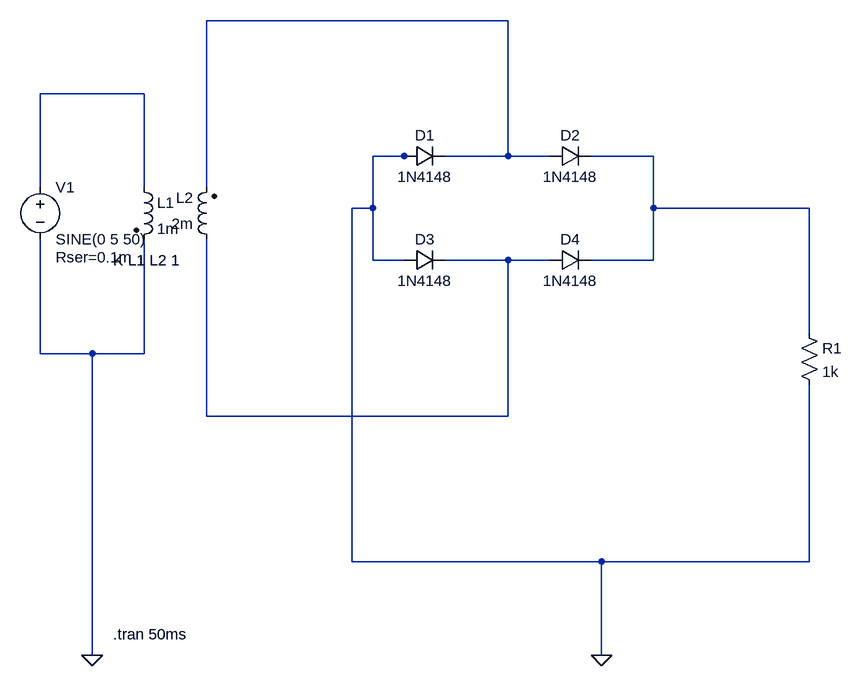
[diagram p0: schematic Resistive_Load_Full_Wave_Rectifier.asc]
Resistive_Load_Full_Wave_Rectifier.asc, the LTspice schematic file:
Version 4
SHEET 1 880 916
WIRE 224 -80 -240 -80
WIRE -336 32 -496 32
WIRE 64 128 16 128
WIRE 80 128 64 128
WIRE 224 128 224 -80
WIRE 224 128 128 128
WIRE 288 128 224 128
WIRE 448 128 352 128
WIRE -496 176 -496 32
WIRE -336 176 -336 32
WIRE -240 176 -240 -80
WIRE 16 208 16 128
WIRE 16 208 -16 208
WIRE 448 208 448 128
WIRE 688 208 448 208
WIRE 16 288 16 208
WIRE 64 288 16 288
WIRE 224 288 128 288
WIRE 288 288 224 288
WIRE 448 288 448 208
WIRE 448 288 352 288
WIRE 688 400 688 208
WIRE -496 432 -496 256
WIRE -416 432 -496 432
WIRE -336 432 -336 256
WIRE -336 432 -416 432
WIRE -240 528 -240 256
WIRE 224 528 224 288
WIRE 224 528 -240 528
WIRE -16 752 -16 208
WIRE 368 752 -16 752
WIRE 688 752 688 480
WIRE 688 752 368 752
WIRE -416 896 -416 432
WIRE 368 896 368 752
FLAG -416 896 0
FLAG 368 896 0
SYMBOL diode 64 144 R270
WINDOW 0 32 32 VTop 2
WINDOW 3 0 32 VBottom 2
SYMATTR InstName D1
SYMATTR Value 1N4148
SYMBOL diode 288 144 R270
WINDOW 0 32 32 VTop 2
WINDOW 3 0 32 VBottom 2
SYMATTR InstName D2
SYMATTR Value 1N4148
SYMBOL diode 64 304 R270
WINDOW 0 32 32 VTop 2
WINDOW 3 0 32 VBottom 2
SYMATTR InstName D3
SYMATTR Value 1N4148
SYMBOL diode 288 304 R270
WINDOW 0 32 32 VTop 2
WINDOW 3 0 32 VBottom 2
SYMATTR InstName D4
SYMATTR Value 1N4148
SYMBOL voltage -496 160 R0
WINDOW 123 0 0 Left 0
WINDOW 39 24 124 Left 2
SYMATTR InstName V1
SYMATTR Value SINE(0 5 50)
SYMATTR SpiceLine Rser=0.1m
SYMBOL ind2 -352 160 R0
SYMATTR InstName L1
SYMATTR Value 1m
SYMATTR Type ind
SYMBOL ind2 -224 272 R180
WINDOW 0 36 80 Left 2
WINDOW 3 36 40 Left 2
SYMATTR InstName L2
SYMATTR Value 2m
SYMATTR Type ind
SYMBOL res 672 384 R0
SYMATTR InstName R1
SYMATTR Value 1k
TEXT -384 288 Left 2 !K L1 L2 1
TEXT -384 864 Left 2 !.tran 50ms

The netlist it stands for:
* Resistive_Load_Full_Wave_Rectifier.asc
D1 0 N001 1N4148
D2 N001 N003 1N4148
D3 0 N004 1N4148
D4 N004 N003 1N4148
V1 N002 0 SINE(0 5 50) Rser=0.1m
L1 N002 0 1m
L2 N004 N001 2m
R1 N003 0 1k
.model D D
.lib standard.dio
K L1 L2 1
.tran 50ms
.backanno
.end